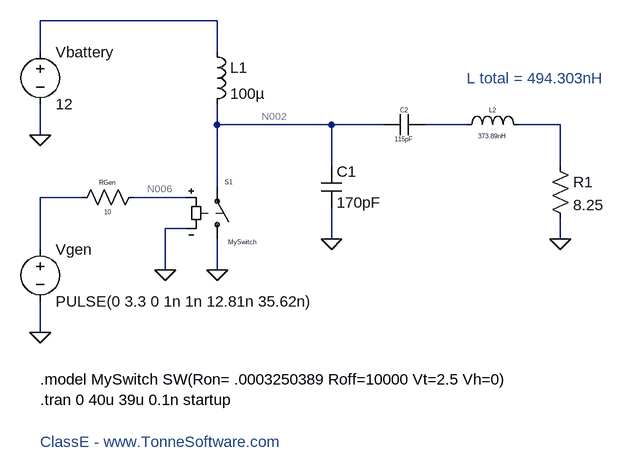
[diagram p0: schematic class_e_10mhz_final.asc]
class_e_10mhz_final.asc, the LTspice schematic file:
Version 4
SHEET 1 1104 392
WIRE 272 -272 0 -272
WIRE 0 -224 0 -272
WIRE 272 -224 272 -272
WIRE 272 -112 272 -144
WIRE 448 -112 272 -112
WIRE 528 -112 448 -112
WIRE 656 -112 592 -112
WIRE 800 -112 736 -112
WIRE 0 -96 0 -144
WIRE 448 -48 448 -112
WIRE 800 -48 800 -112
WIRE 272 -16 272 -112
WIRE 64 0 0 0
WIRE 224 0 144 0
WIRE 224 48 192 48
WIRE 448 64 448 16
WIRE 800 64 800 32
WIRE 0 80 0 0
WIRE 192 112 192 48
WIRE 272 112 272 64
WIRE 0 208 0 160
FLAG 192 112 0
FLAG 0 208 0
FLAG 272 112 0
FLAG 0 -96 0
FLAG 448 64 0
FLAG 800 64 0
SYMBOL voltage 0 -240 R0
WINDOW 123 24 132 Left 0
SYMATTR InstName Vbattery
SYMATTR Value 12
SYMBOL voltage 0 64 R0
WINDOW 123 24 132 Left 0
WINDOW 39 0 0 Left 0
SYMATTR InstName Vgen
SYMATTR Value PULSE(0 3.3 0 1n 1n 12.81n 35.62n)
SYMBOL res 160 -16 R90
WINDOW 0 0 56 VBottom 0
WINDOW 3 32 56 VTop 0
SYMATTR InstName RGen
SYMATTR Value 10
SYMBOL ind 256 -240 R0
SYMATTR InstName L1
SYMATTR Value 100µ
SYMBOL sw 272 80 M180
WINDOW 0 12 104 Left 0
WINDOW 3 17 11 Left 0
SYMATTR InstName S1
SYMATTR Value MySwitch
SYMBOL cap 432 -48 R0
SYMATTR InstName C1
SYMATTR Value 170pF
SYMBOL cap 592 -128 R90
WINDOW 0 0 32 VBottom 0
WINDOW 3 32 32 VTop 0
SYMATTR InstName C2
SYMATTR Value 115pF
SYMBOL ind 640 -96 R270
WINDOW 0 32 56 VTop 0
WINDOW 3 5 56 VBottom 0
SYMATTR InstName L2
SYMATTR Value 373.89nH
SYMBOL res 784 -64 R0
SYMATTR InstName R1
SYMATTR Value 8.25
TEXT 0 280 Left 2 !.model MySwitch SW(Ron= .0003250389 Roff=10000 Vt=2.5 Vh=0)
TEXT 0 312 Left 2 !.tran 0 40u 39u 0.1n startup
TEXT 0 376 Left 2 ;ClassE - www.TonneSoftware.com
TEXT 656 -184 Left 2 ;L total = 494.303nH

The netlist it stands for:
* class_e_10mhz_final.asc
Vbattery N001 0 12
Vgen N005 0 PULSE(0 3.3 0 1n 1n 12.81n 35.62n)
RGen N006 N005 10
L1 N001 N002 100µ
S1 0 N002 N006 0 MySwitch
C1 N002 0 170pF
C2 N003 N002 115pF
L2 N003 N004 373.89nH
R1 N004 0 8.25
.model MySwitch SW(Ron= .0003250389 Roff=10000 Vt=2.5 Vh=0)
.tran 0 40u 39u 0.1n startup
* ClassE - www.TonneSoftware.com
* L total = 494.303nH
.backanno
.end

* Results of the author's LTspice run, read from the files saved beside the schematic
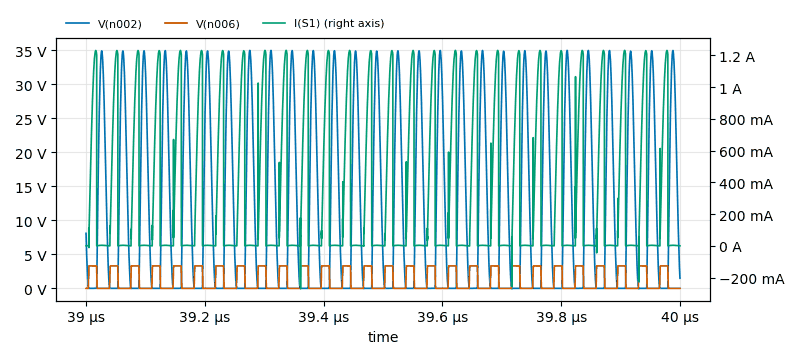
[diagram p1: Transient Analysis of class_e_10mhz_final.asc, plotted from the saved traces]
* Transient Analysis, 1 run:
*   V(n002): min -65.95 mV, max 35 V, average 11.96 V, rms 17.91 V, last 1.483 V
*   V(n006): min 0 V, max 3.305 V, average 1.276 V, rms 2.028 V, last 0 V
*   I(S1): min -270.5 mA, max 1.231 A, average 315.1 mA, rms 562.9 mA, last 148.3 µA